# EAGLE design control_bat (EAGLE 7.0.0)
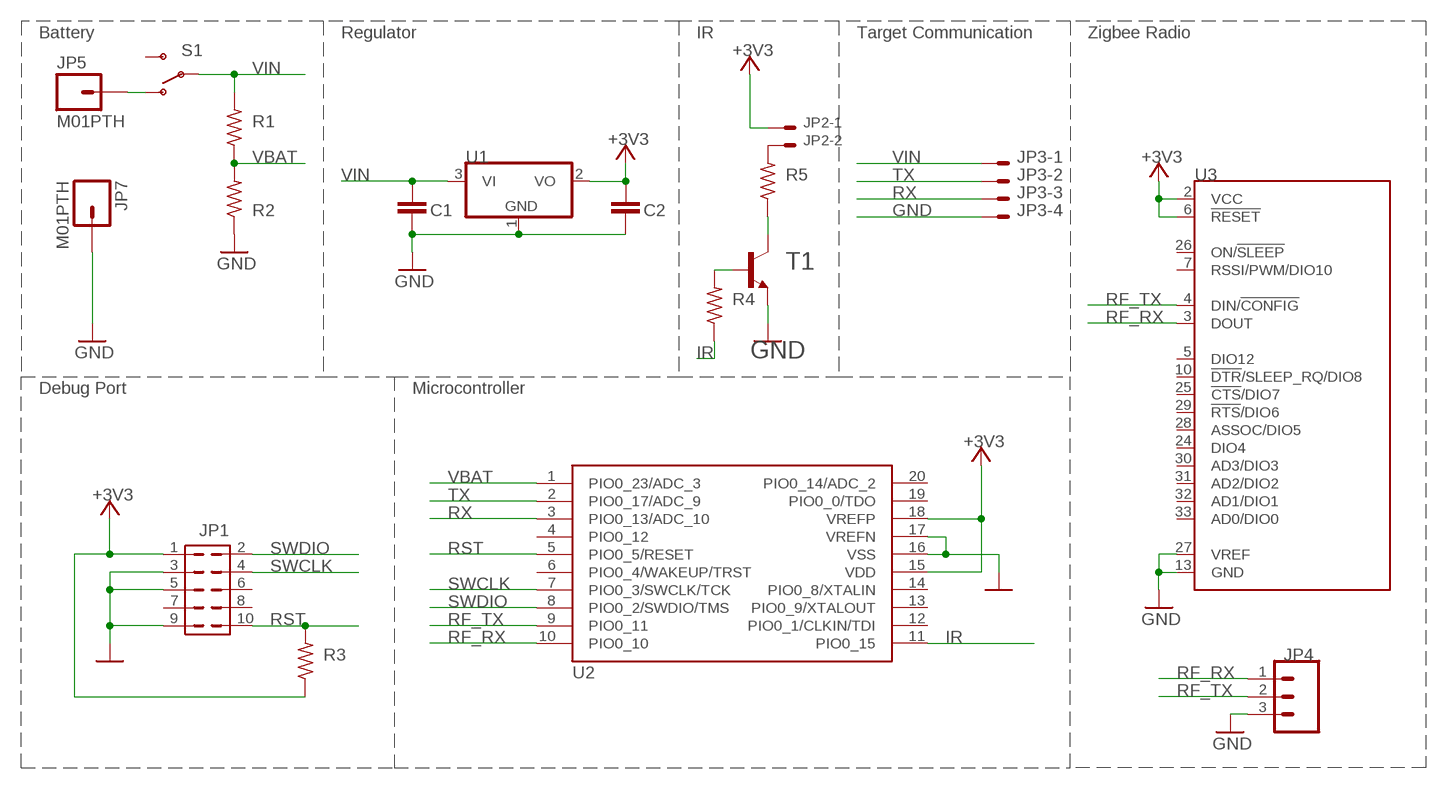
[diagram p0: schematic, sheet 1]

## Parts
C1  C1608X5R1C106M080AB  CAP0603-CAP  [0603-CAP]
C2  C1608X5R1C106M080AB  CAP0603-CAP  [0603-CAP]
JP1  FTSH-105-01-L  FTSH-105  [FTSH-105-01-XXX-DV-K]
JP2  798-DF132P125V20  53398-02  [53398-02]
JP3  798-DF134P125V20  53398-04  [53398-04]
JP4  M03PTH  [1X03]
JP5  M01PTH  [1X01]
JP7  M01PTH  [1X01]
R1  71-CRCW0603-10K-E3  R-US_R0603  [R0603]
R2  71-CRCW0603-10K-E3  R-US_R0603  [R0603]
R3  71-CRCW0603-10K-E3  R-US_R0603  [R0603]
R4  71-CRCW0603220RFKEB  R-US_R0603  [R0603]
R5  71-CRCW0603-5.6-E3  R-US_R0603  [R0603]
S1  612-EG1270  SWITCH-SPST  [EG1270]
T1  PMBT4401,215  MMBT4401LT1-NPN-SOT23-BEC  [SOT23-BEC]
U1  579-MCP1703T-3002ECB  MCP1703CB  [SOT23]
U2  771-LPC824M201JDH20J  LPC824  [TSSOP20]
U3  888-XB24CZ7PIS-004  XBEE-SMT  [XBEE-SMT]

## Nets
+3V3: C2.1 JP1.1 JP2.1 R3.1 U1.2(VO) U2.15(VDD) U2.18(VREFP) U3.2(VCC) U3.6(!RESET)
GND: C1.2 C2.2 JP1.3 JP1.5 JP1.9 JP3.4 JP4.3 JP7.1 R2.1 T1.E U1.1(GND) U2.16(VSS) U2.17(VREFN) U3.13(GND) U3.27(VREF)
IR: R4.1 U2.11(PIO0_15)
N$1: JP5.1 S1.P$1(O)
N$4: JP2.2 R5.2
N$5: R5.1 T1.C
N$6: R4.2 T1.B
RF_RX: JP4.1 U2.10(PIO0_10) U3.3(DOUT)
RF_TX: JP4.2 U2.9(PIO0_11) U3.4(DIN/!CONFIG)
RST: JP1.10 R3.2 U2.5(PIO0_5/RESET)
RX: JP3.3 U2.3(PIO0_13/ADC_10)
SWCLK: JP1.4 U2.7(PIO0_3/SWCLK/TCK)
SWDIO: JP1.2 U2.8(PIO0_2/SWDIO/TMS)
TX: JP3.2 U2.2(PIO0_17/ADC_9)
VBAT: R1.1 R2.2 U2.1(PIO0_23/ADC_3)
VIN: C1.1 JP3.1 R1.2 S1.P$2(P) U1.3(VI)
Unconnected: JP1.6 JP1.7 JP1.8 S1.P$3(S) U2.4(PIO0_12) U2.6(PIO0_4/WAKEUP/TRST) U2.12(PIO0_1/CLKIN/TDI) U2.13(PIO0_9/XTALOUT) U2.14(PIO0_8/XTALIN) U2.19(PIO0_0/TDO) U2.20(PIO0_14/ADC_2) U3.5(DIO12) U3.7(RSSI/PWM/DIO10) U3.10(!DTR!/SLEEP_RQ/DIO8) U3.24(DIO4) U3.25(!CTS!/DIO7) U3.26(ON/!SLEEP) U3.28(ASSOC/DIO5) U3.29(!RTS!/DIO6) U3.30(AD3/DIO3) U3.31(AD2/DIO2) U3.32(AD1/DIO1) U3.33(AD0/DIO0)

## Notes on the sheet
- Battery | Regulator | IR | Target Communication | Zigbee Radio
- Debug Port | Microcontroller

## Library data of the parts
C1 C2 = SparkFun-Passives:CAP: Capacitor Standard 0603 ceramic capacitor, and 0.1" leaded capacitor.
JP1 = torpedo:FTSH-105
JP2 = con-molex:53?-02: CONNECTOR wire to board 1.25 mm (.049 inch) pitch header; OC_FARNELL: unknown; OC_NEWARK: unknown
JP3 = con-molex:53?-04: CONNECTOR wire to board 1.25 mm (.049 inch) pitch header; OC_FARNELL: 1125367; OC_NEWARK: unknown
JP4 = SparkFun-Connectors:M03: Header 3 Standard 3-pin 0.1" header. Use with straight break away headers (SKU : PRT-00116), right angle break away headers (PRT-00553), swiss pins (PRT-00743), machine pins (PRT-00117), and female headers (PRT-00115). Molex polarized connector foot print use with SKU : PRT-08232 with associated crimp pins and housings.
JP5 JP7 = SparkFun-Connectors:M01: Header 1 Standard 1-pin 0.1" header. Use with straight break away headers (SKU : PRT-00116), right angle break away headers (PRT-00553), swiss pins (PRT-00743), machine pins (PRT-00117), and female headers (PRT-00115).
R1-R5 = rcl:R-US_: RESISTOR, American symbol
S1 = torpedo:SWITCH-SPST: SPST Switch Simple slide switch. Spark Fun Electronics SKU : COM-00102
T1 = transistor:*-NPN-: NPN Transistror BF959 corrected 2008.03.06
U1 = linear:MCP1703: 250 mA, 16V, Low Quiescent Current LDO Regulator Source: http://ww1.microchip.com/downloads/en/DeviceDoc/22049b.pdf
U2 = torpedo:LPC824
U3 = xbee:XBEE-SMT: XBee(TM)/XBee-PRO(TM) ZB SMT RF Modules. Source: Digi (90002002_a.pdf) (http://www.digi.com/products/wireless-wired-embedded-solutions/zigbee-rf-modules/zigbee-mesh-module/xbee-smt.jsp#overview)

## Net classes
1 PWR: width 0.254 mm, drill 0.406 mm

## Board
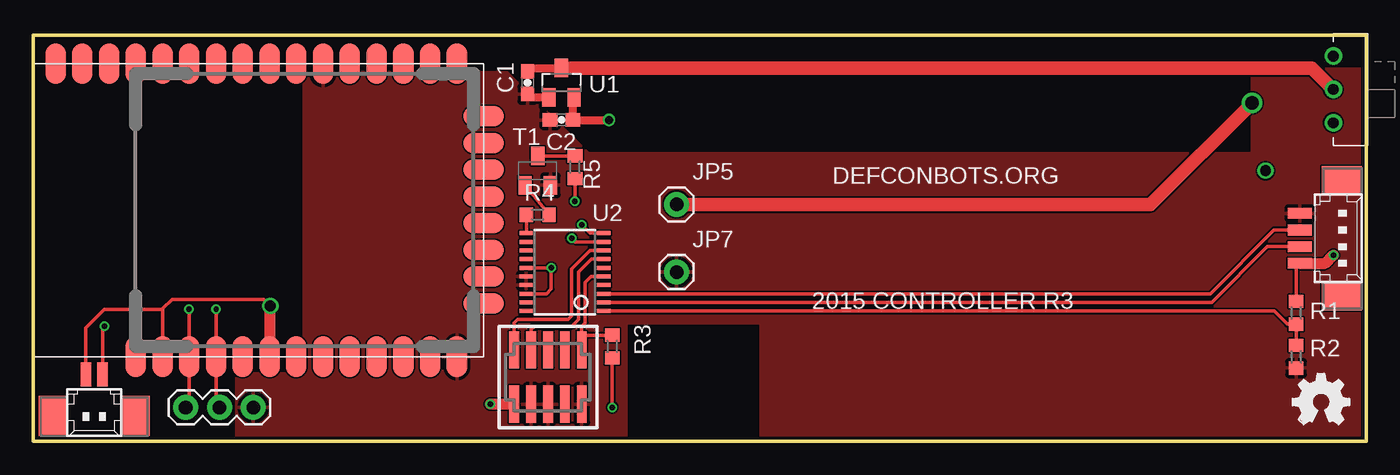
[diagram p1: board, top side]
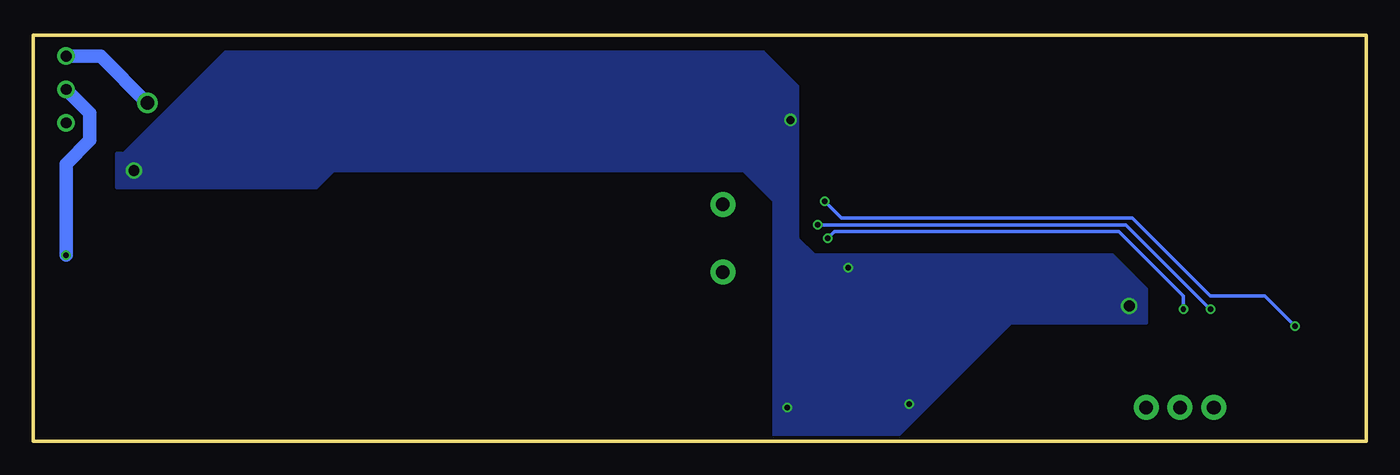
[diagram p2: board, bottom side, seen from below]

Size 100 x 30.48 mm. Coordinates in mm from the lower left corner, seen from the top.
Outline: 0,0 100,0 100,30.48 0,30.48 0,0
Copper layers (1*16): Top 0.035mm / dielectric 1.5mm / Bottom 0.035mm
Design rules "dirt_cheap_dirty_boards.v1": minimum track width 5mil, minimum drill 12mil, track to track 5mil, track to pad 5mil, pad to pad 5mil, via to via 5mil, smd to smd 0mil, copper to edge 10mil, drill to drill 10mil, minimum pad ring 10mil, minimum via ring 6mil, stop-mask expansion 2mil, vias tented up to drill 25mil, thermal gap 10mil

### Footprints (pad centres in the part's own frame; a part is rotated, then mirrored left to right if it is on the bottom)
0603-CAP = smd 1.1 x 1: 1 -0.85,0; 2 0.85,0
FTSH-105-01-XXX-DV-K = smd 0.737 x 2.794: 1 -2.54,-2.032; 2 -2.54,2.032; 3 -1.27,-2.032; 4 -1.27,2.032; 5 0,-2.032; 6 0,2.032; 7 1.27,-2.032; 8 1.27,2.032; 9 2.54,-2.032; 10 2.54,2.032
53398-02 = smd 0.8 x 1.8: 1 0.625,-2.5; 2 -0.625,-2.5 | smd 2.1 x 3: S1 3.125,0.625; S2 -3.125,0.625
53398-04 = smd 0.8 x 1.8: 1 1.875,-2.5; 2 0.625,-2.5; 3 -0.625,-2.5; 4 -1.875,-2.5 | smd 2.1 x 3: S1 4.375,0.625; S2 -4.375,0.625
1X03 = drill 1.016 pad 1.88: 1 0,0; 2 2.54,0; 3 5.08,0
1X01 = drill 1.016 pad 1.88: 1 0,0
R0603 = smd 1 x 1.1: 1 -0.85,0; 2 0.85,0
EG1270 = drill 0.8: P$1 0,2.5; P$2 0,0; P$3 0,-2.5
SOT23-BEC = smd 1 x 1.4: B -0.95,-1.1; C 0,1.1; E 0.95,-1.1
SOT23 = smd 1 x 1.4: 1 -0.95,-1.1; 2 0.95,-1.1; 3 0,1.1
TSSOP20 = smd 0.305 x 0.991: 1 -2.925,-2.918; 2 -2.275,-2.918; 3 -1.625,-2.918; 4 -0.975,-2.918; 5 -0.325,-2.918; 6 0.325,-2.918; 7 0.975,-2.918; 8 1.625,-2.918; 9 2.275,-2.918; 10 2.925,-2.918; 11 2.925,2.918; 12 2.275,2.918; 13 1.625,2.918; 14 0.975,2.918; 15 0.325,2.918; 16 -0.325,2.918; 17 -0.975,2.918; 18 -1.625,2.918; 19 -2.275,2.918; 20 -2.925,2.918
XBEE-SMT = smd 3.048 x 1.524: 1 0,26.086; 2 0,24.079; 3 0,22.073; 4 0,20.066; 5 0,18.059; 6 0,16.053; 7 0,14.046; 8 0,12.04; 9 0,10.033; 10 0,8.026; 11 0,6.02; 12 0,4.013; 13 0,2.007; 22 21.996,2.007; 23 21.996,4.013; 24 21.996,6.02; 25 21.996,8.026; 26 21.996,10.033; 27 21.996,12.04; 28 21.996,14.046; 29 21.996,16.053; 30 21.996,18.059; 31 21.996,20.066; 32 21.996,22.073; 33 21.996,24.079; 34 21.996,26.086; 35 21.996,28.092; 36 21.996,30.099; 37 21.996,32.106 | smd 1.524 x 3.048: 14 4.013,0; 15 6.02,0; 16 8.026,0; 17 10.033,0; 18 12.04,0; 19 14.046,0; 20 16.053,0; 21 18.059,0

### Placement (x,y rotation side)
C1  37.08,26.92 270 top
C2  39.62,24.13 180 top
JP1  38.61,4.83 0 top
JP2  4.57,2.54 180 top
JP3  97.54,15.24 270 top
JP4  11.43,2.54 0 top
JP5  48.26,17.78 0 top
JP7  48.26,12.7 0 top
LOGO1  OSHW_LOGO_FILLX0150-NT  [OSHW_FILLX150_NOTEXT]  94.49,1.27 0 top
R1  94.74,9.65 90 top
R2  94.74,6.35 90 top
R3  43.43,7.11 90 top
R4  37.85,17.02 0 top
R5  40.64,20.57 270 top
S1  97.54,26.42 0 top
T1  37.85,20.32 0 top
U1  39.62,26.92 0 top
U2  39.88,12.7 90 top
U3  33.78,6.35 90 top

### Tracks (layer width: path | path; a pad name or v marks a point on that pad's centre or on a via)
+3V3  (via drill 0.41, 0.6, 0.81)
  Top 0.254: U2.15 v38.86,13.03 38.86,11.43 38.51,11.07 U2.18 | U3.2 9.7,9.91 | 9.7,9.91 9.7,9.96 10.41,10.67 17.27,10.67 v17.78,10.16 | R3.1 v43.43,2.54 | JP2.1 3.95,8.52 5.33,9.91 9.7,9.91
  Top 0.508: U3.6 17.78,6.4
  Top 0.61: U1.2 40.47,25.72 C2.1 v43.18,24.13
  Top 0.813: 17.78,6.4 v17.78,10.16 | JP1.1 v34.29,2.79
  other vias: 92.46,20.32
  pour Bottom: 16.51,11.43 19.05,13.97 41.4,13.97 42.67,15.24 42.67,26.67 45.21,29.21 85.6,29.21 93.22,21.59 93.73,21.59 93.73,19.05 78.74,19.05 77.47,20.32 46.74,20.32 44.45,18.03 44.45,0 35.56,0 26.67,8.89 16.51,8.89
GND
  Top 0.61: C1.2 37.33,25.82 U1.1
  pour Top: 20.32,27.69 35.56,27.69 41.66,21.59 91.44,21.59 91.44,27.94 100.08,27.94 100.08,-0.76 54.61,-0.76 54.61,8.89 44.45,8.89 44.45,-0.76 15.24,-0.76 15.24,5.08 20.32,5.08
IR
  Top 0.254: U2.11 37,15.62 R4.1
N$1  (via drill 1.02)
  Top 1.016: JP5.1 83.82,17.78 v91.44,25.4
  Bottom 1.016: v91.44,25.4 94.96,28.92 S1.P$1
N$4  (via drill 0.41)
  Top 0.254: R5.2 v40.64,18.03 | v5.33,8.64 5.2,8.5 JP2.2
  Bottom 0.254: v40.64,18.03 39.37,16.76 17.53,16.76 11.68,10.92 7.62,10.92 v5.33,8.64
N$5
  Top 0.254: T1.C R5.1
N$6
  Top 0.254: R4.2 T1.B
RF_RX  (via drill 0.41)
  Top 0.254: v41.15,16.26 41.78,15.62 U2.10 | v11.68,9.91 11.68,6.38 U3.3 11.71,2.82 JP4.1
  Bottom 0.254: v41.15,16.26 18.03,16.26 v11.68,9.91
RF_TX  (via drill 0.41)
  Top 0.254: v40.39,15.24 40.65,14.97 U2.9 | v13.72,9.91 U3.4 13.72,2.79 JP4.2
  Bottom 0.254: v40.39,15.24 39.88,15.75 18.54,15.75 13.72,10.92 v13.72,9.91
RST
  Top 0.254: JP1.10 41.15,7.87 41.15,7.96 | 41.15,7.96 41.15,8.64 41.4,8.89 41.4,11.94 41.84,12.38 U2.5 | R3.2 41.15,7.96
RX
  Top 0.254: JP3.3 93.08,15.87 88.29,11.07 U2.3
SWCLK
  Top 0.254: U2.7 41.87,13.68 40.89,12.7 40.89,9.14 40.39,8.64 37.59,8.64 37.34,8.38 JP1.4
SWDIO
  Top 0.254: U2.8 41.76,14.32 40.39,12.95 40.39,9.4 40.13,9.14 36.32,9.14 36.07,8.89 JP1.2
TX
  Top 0.254: JP3.2 92.59,14.62 88.4,10.43 U2.2
VBAT
  Top 0.254: R2.2 R1.1 94.07,8.8 93.09,9.78 U2.1
VIN  (via drill 0.41)
  Top 0.254: R1.2 94.74,13.21 94.9,13.37 JP3.1
  Top 0.61: C1.1 37.33,28.02 U1.3
  Top 0.813: JP3.1 96.93,13.37 v97.54,13.97
  Top 1.016: U1.3 95.93,28.02 S1.P$2
  Bottom 1.016: S1.P$2 95.76,24.64 95.76,22.61 97.54,20.83 v97.54,13.97

### Text on the board
tPlace: DEFCONBOTS.ORG | 2015 CONTROLLER R3